# EasyEDA Pro project ESP32_陀螺仪开发板.eprj

# Schematic MainBoard
Create Date: 2023-11-03; Page Name: P1; Project Name: ESP32_陀螺仪开发板; Schematic Name: MainBoard; Update Date: 2023-11-21; Company: 生物科学与医学工程学院; Drawed: 程浩; Page Size: A4; Version: V1.0
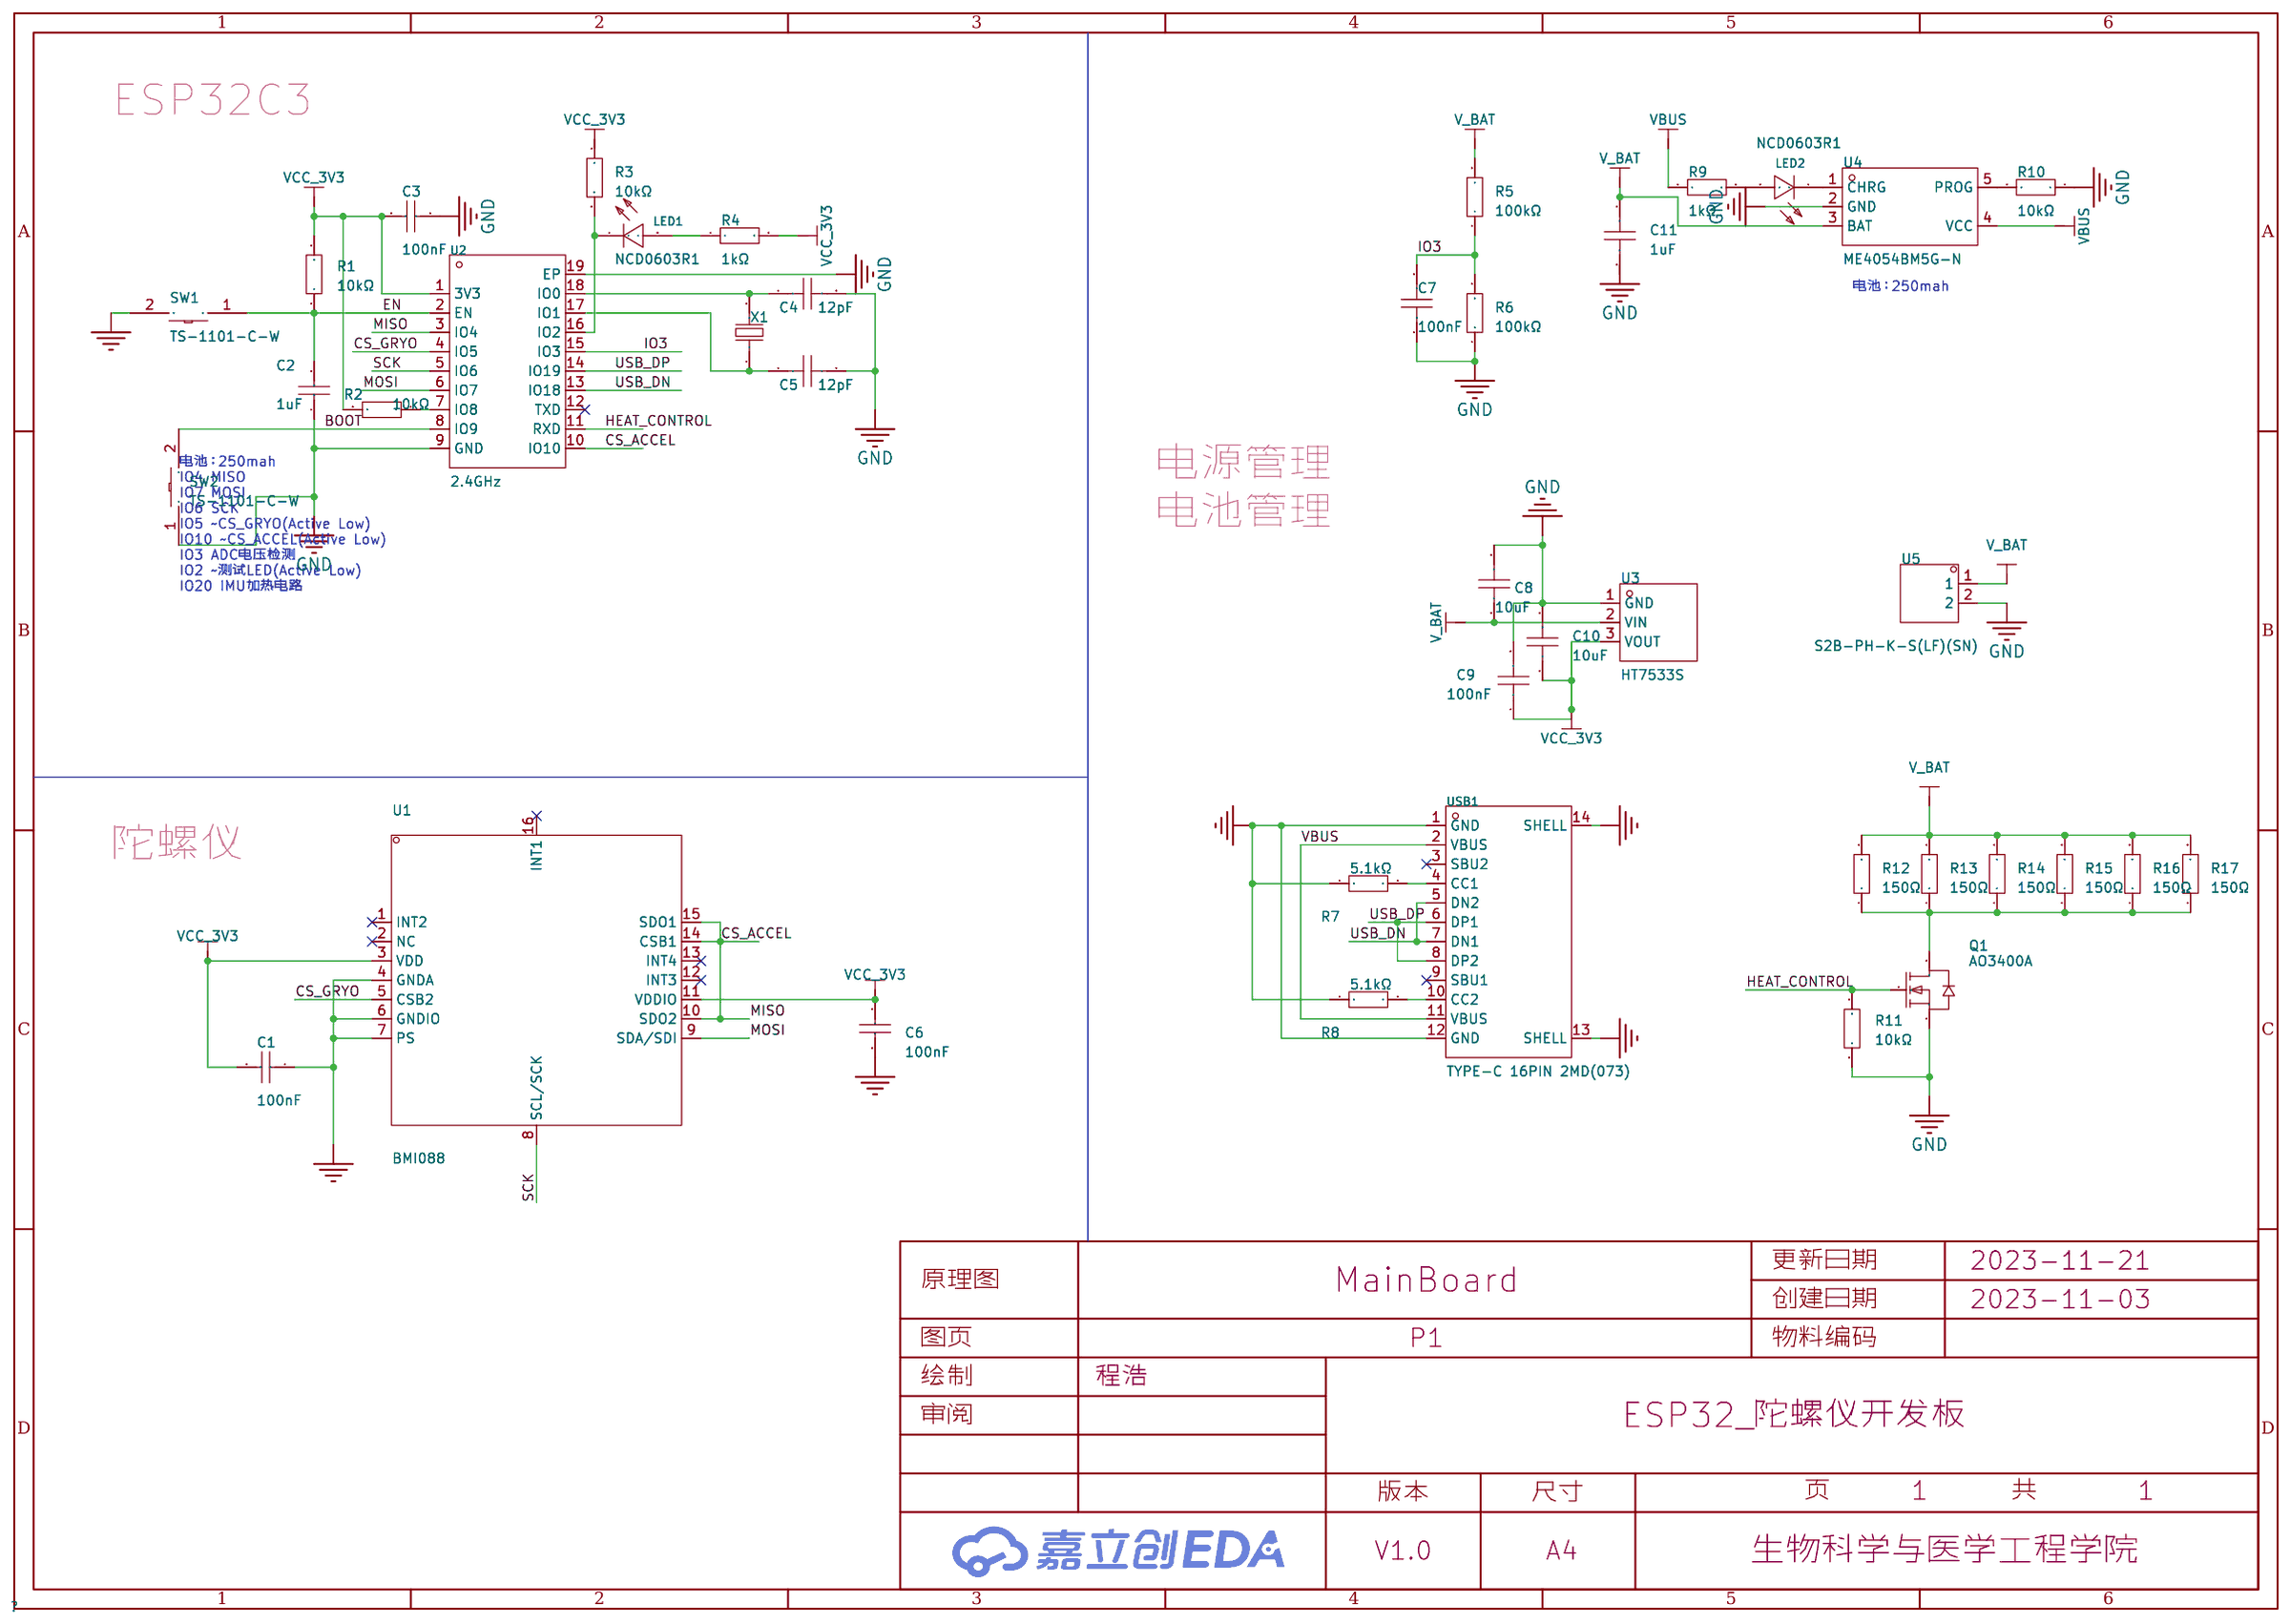
[diagram p0: schematic sheet]

## Parts
C1  100nF  [C0603]
C2  1uF  [C0603]
C3  100nF  [C0603]
C4  12pF  [C0603]
C5  12pF  [C0603]
C6  100nF  [C0603]
C7  100nF  [C0603]
C8  10uF  [C0603]
C9  100nF  [C0603]
C10  10uF  [C0603]
C11  1uF  [C0603]
LED1  NCD0603R1  [LED0603-RD_RED]
LED2  NCD0603R1  [LED0603-RD_RED]
Q1  AO3400A  [SOT-23-3_L2.9-W1.3-P1.90-LS2.4-BR]
R1  10kΩ  [R0603]
R2  10kΩ  [R0603]
R3  10kΩ  [R0603]
R4  1kΩ  [R0603]
R5  100kΩ  [R0603]
R6  100kΩ  [R0603]
R7  5.1kΩ  [R0603]
R8  5.1kΩ  [R0603]
R9  1kΩ  [R0603]
R10  10kΩ  [R0603]
R11  10kΩ  [R0603]
R12  150Ω  [R0603]
R13  150Ω  [R0603]
R14  150Ω  [R0603]
R15  150Ω  [R0603]
R16  150Ω  [R0603]
R17  150Ω  [R0603]
SW1  TS-1101-C-W  [SW-SMD_L6.0-W3.3-LS8.0]
SW2  TS-1101-C-W  [SW-SMD_L6.0-W3.3-LS8.0]
U1  BMI088  [LGA-16_L4.5-W3.0-P0.50-BL]
U2  2.4GHz  [BULETM-SMD_ESPRESSIF_ESP32-C3-WROOM-02-N4-4MB]
U3  HT7533S  [SOT-23-3_L2.9-W1.5-P1.90-LS2.8-BR-CW]
U4  ME4054BM5G-N  [TSOT-23-5_L2.9-W1.6-P0.95-LS2.8-BL]
U5  S2B-PH-K-S(LF)(SN)  [CONN-TH_S2B-PH-K-S-LF-SN]
USB1  TYPE-C 16PIN 2MD(073)  [USB-C-SMD_TYPE-C-6PIN-2MD-073]
X1  32.768kHz  [FC-135R_L3.2-W1.5]

## Library data of the parts
C1 C3 C6 C7 C9 = CC0603KRX7R9BB104: 容值:100nF;精度:±10%;额定电压:50V;材质(温度系数):X7R;; LCSC Part Name: 100nF ±10% 50V; Supplier Part: C14663; Manufacturer: YAGEO(国巨); Supplier Footprint: 0603; JLCPCB Part Class: Basic Part; Datasheet: https://atta.szlcsc.com/upload/public/pdf/source/20180910/C282072_33301C7F631E79921B82A8DAC6BCC5B3.pdf; Supplier: LCSC; Tolerance: ±10%; Voltage Rated: 50V; Temperature Coefficient: X7R
C2 = CL10A105KA8NNNC: 容值:1uF;精度:±10%;额定电压:25V;温度系数:X5R;; LCSC Part Name: 1uF±10%25V; Supplier Part: C5673; Manufacturer: SAMSUNG(三星); Supplier Footprint: 0603; JLCPCB Part Class: ExtendedPart; Datasheet: https://atta.szlcsc.com/upload/public/pdf/source/20160103/1457707739994.pdf; Supplier: LCSC; Tolerance: ±10%; Voltage Rated: 25V; Temperature Coefficient: X5R
C4 C5 = CL10C120JB8NNNC: 容值:12pF;精度:±5%;额定电压:50V;材质(温度系数):C0G;; LCSC Part Name: 12pF ±5% 50V; Supplier Part: C38523; Manufacturer: SAMSUNG(三星); Supplier Footprint: 0603; JLCPCB Part Class: Basic Part; Datasheet: https://atta.szlcsc.com/upload/public/pdf/source/20160218/1457707763339.pdf; Supplier: LCSC; Tolerance: ±5%; Voltage Rated: 50V; Temperature Coefficient: C0G
C8 C10 = CL10A106MA8NRNC: 容值:10uF;精度:±20%;额定电压:25V;材质(温度系数):X5R;; LCSC Part Name: 10uF ±20% 25V; Supplier Part: C96446; Manufacturer: SAMSUNG(三星); Supplier Footprint: 0603; JLCPCB Part Class: Basic Part; Datasheet: https://atta.szlcsc.com/upload/public/pdf/source/20170325/1490427913016.pdf; Supplier: LCSC; Tolerance: ±20%; Voltage Rated: 25V; Temperature Coefficient: X5R
C11 = CL10A105KB8NNNC: 容值:1uF;精度:±10%;额定电压:50V;材质(温度系数):X5R;; LCSC Part Name: 1uF ±10% 50V; Supplier Part: C15849; Manufacturer: SAMSUNG(三星); Supplier Footprint: 0603; JLCPCB Part Class: Basic Part; Datasheet: https://atta.szlcsc.com/upload/public/pdf/source/20160103/1457707679084.pdf; Supplier: LCSC; Tolerance: ±10%; Voltage Rated: 50V; Temperature Coefficient: X5R
LED1 LED2 = NCD0603R1_C84263: 发光颜色:红灯;; LCSC Part Name: 红灯 0603红灯   正贴; Supplier Part: C84263; Manufacturer: 国星光电; Supplier Footprint: 0603; JLCPCB Part Class: 扩展库; Datasheet: https://atta.szlcsc.com/upload/public/pdf/source/20200820/C84263_DABC6A75E58F576973B407FDBA283D60.pdf; Supplier: LCSC; Emitted Color: 红灯
Q1 = AO3400A_C347475: 类型:N沟道;漏源电压(Vdss):30V;连续漏极电流(Id):5.8A;功率(Pd):1.4W;导通电阻(RDS(on)@Vgs,Id):35mΩ@10V,5.8A;; LCSC Part Name: N沟道 30V 5.8A; Supplier Part: C347475; Manufacturer: UMW(广东友台半导体); Supplier Footprint: SOT-23; JLCPCB Part Class: Extended Part; Datasheet: https://atta.szlcsc.com/upload/public/pdf/source/20220429/98B7D6B2B83615ED4523A0C76368EB06.pdf; Supplier: LCSC; Type: N沟道; Drain Source Voltage (Vdss): 30V; Continuous Drain Current (Id): 5.8A; Power Dissipation (Pd): 1.4W; Drain Source On Resistance (RDS(on)@Vgs,Id): 35mΩ@10V,5.8A; Gate Threshold Voltage (Vgs(th)@Id): 1.4V@250uA; Total Gate Charge (Qg@Vgs): 12nC@4.5V; Input Capacitance (Ciss@Vds): 1.05nF@15V; Operating Temperature: -55℃~+150℃@(Tj)
R1-R3 R11 = 0603WAF1002T5E: 电阻类型:厚膜电阻;阻值:10kΩ;精度:±1%;功率:100mW;; LCSC Part Name: 厚膜电阻 10kΩ ±1% 100mW; Supplier Part: C25804; Manufacturer: UNI-ROYAL(厚声); Supplier Footprint: 0603; JLCPCB Part Class: Basic Part; Datasheet: https://atta.szlcsc.com/upload/public/pdf/source/20200306/C422600_1E6D84923E4A46A82E41ADD87F860B5C.pdf; Supplier: LCSC; Type: 厚膜电阻; Tolerance: ±1%; Power(Watts): 100mW; Temperature Coefficient: ±100ppm/℃; Overload Voltage (Max): 75V; Operating Temperature Range: -55℃~+155℃
R4 = 0603WAF1001T5E: 电阻类型:厚膜电阻;阻值:1kΩ;精度:±1%;功率:100mW;温度系数:±100ppm/℃;; LCSC Part Name: 厚膜电阻 1kΩ ±1% 100mW; Supplier Part: C21190; Manufacturer: UNI-ROYAL(厚声); Supplier Footprint: 0603; JLCPCB Part Class: Basic Part; Datasheet: https://atta.szlcsc.com/upload/public/pdf/source/20200306/C422600_1E6D84923E4A46A82E41ADD87F860B5C.pdf; Supplier: LCSC; Type: 厚膜电阻; Tolerance: ±1%; Power(Watts): 100mW; Temperature Coefficient: ±100ppm/℃; Overload Voltage (Max): 75V; Operating Temperature Range: -55℃~+155℃
R5 R6 = 0603WAF1003T5E: 电阻类型:厚膜电阻;阻值:100kΩ;精度:±1%;功率:100mW;; LCSC Part Name: 100kΩ ±1% 100mW; Supplier Part: C25803; Manufacturer: UNI-ROYAL(厚声); Supplier Footprint: 0603; JLCPCB Part Class: Basic Part; Datasheet: https://atta.szlcsc.com/upload/public/pdf/source/20200306/C422600_1E6D84923E4A46A82E41ADD87F860B5C.pdf; Supplier: LCSC; Type: 厚膜电阻; Tolerance: ±1%; Power(Watts): 100mW; Temperature Coefficient: ±100ppm/℃; Overload Voltage (Max): 75V; Operating Temperature Range: -55℃~+155℃
R7 R8 = 0603WAF5101T5E: 电阻类型:厚膜电阻;阻值:5.1kΩ;精度:±1%;功率:100mW;; LCSC Part Name: 5.1kΩ ±1% 100mW; Supplier Part: C23186; Manufacturer: UNI-ROYAL(厚声); Supplier Footprint: 0603; JLCPCB Part Class: Basic Part; Datasheet: https://atta.szlcsc.com/upload/public/pdf/source/20200306/C422600_1E6D84923E4A46A82E41ADD87F860B5C.pdf; Supplier: LCSC; Type: 厚膜电阻; Tolerance: ±1%; Power(Watts): 100mW; Temperature Coefficient: ±100ppm/℃; Overload Voltage (Max): 75V; Operating Temperature Range: -55℃~+155℃
R9 = 0603WAF1001T5E: 电阻类型:厚膜电阻;阻值:1kΩ;精度:±1%;功率:100mW;; LCSC Part Name: 1kΩ ±1% 100mW; Supplier Part: C21190; Manufacturer: UNI-ROYAL(厚声); Supplier Footprint: 0603; JLCPCB Part Class: Basic Part; Datasheet: https://atta.szlcsc.com/upload/public/pdf/source/20200306/C422600_1E6D84923E4A46A82E41ADD87F860B5C.pdf; Supplier: LCSC; Type: 厚膜电阻; Tolerance: ±1%; Power(Watts): 100mW; Temperature Coefficient: ±100ppm/℃; Overload Voltage (Max): 75V; Operating Temperature Range: -55℃~+155℃
R10 = 0603WAF2001T5E: 电阻类型:厚膜电阻;阻值:2kΩ;精度:±1%;功率:100mW;; LCSC Part Name: 2kΩ ±1% 100mW; Supplier Part: C22975; Manufacturer: UNI-ROYAL(厚声); Supplier Footprint: 0603; JLCPCB Part Class: Basic Part; Datasheet: https://atta.szlcsc.com/upload/public/pdf/source/20200306/C422600_1E6D84923E4A46A82E41ADD87F860B5C.pdf; Supplier: LCSC; Type: 厚膜电阻; Tolerance: ±1%; Power(Watts): 100mW; Temperature Coefficient: ±100ppm/℃; Overload Voltage (Max): 75V; Operating Temperature Range: -55℃~+155℃
R12-R17 = 0603WAF1500T5E: 电阻类型:厚膜电阻;阻值:150Ω;精度:±1%;功率:100mW;温度系数:±100ppm/℃;; LCSC Part Name: 厚膜电阻 150Ω ±1% 100mW; Supplier Part: C22808; Manufacturer: UNI-ROYAL(厚声); Supplier Footprint: 0603; JLCPCB Part Class: 基础库; Datasheet: https://atta.szlcsc.com/upload/public/pdf/source/20200306/C422600_1E6D84923E4A46A82E41ADD87F860B5C.pdf; Supplier: LCSC; Type: 厚膜电阻; Tolerance: ±1%; Power(Watts): 100mW; Temperature Coefficient: ±100ppm/℃; Overload Voltage (Max): 75V; Operating Temperature Range: -55℃~+155℃
SW1 SW2 = TS-1101-C-W: 触点电流:50mA;额定电压(AC):-;额定电压(DC):12V;额定功率:-;绝缘电阻:-;电路结构:单刀单掷;安装方式:立贴;带灯:无;作用力:260gf;机械寿命:5万次;带支架:否;; LCSC Part Name: 立贴 6*3.6*2.5mm 轻触开关 一型3*6*2.5有白ZD b拉伸白色带淡绿按键 卷装; Supplier Part: C318938; Manufacturer: XKB Connectivity(中国星坤); Supplier Footprint: SMD; JLCPCB Part Class: Extended Part; Datasheet: https://atta.szlcsc.com/upload/public/pdf/source/20200227/C318938_C2E53B1EEDE37D980A33616AC086DE53.pdf; Supplier: LCSC; Contact Current: 50mA; Voltage Rating (DC): 12V; Circuit: 单刀单掷; Mounting Style: 立贴; Actuator Style: 矩形按钮; Actuator/Cap Color: 白色带淡绿; With Lamp: 无; Operating Force: 260gf; Mechanical Life: 5万次; Operating Temperature: -30℃~+85℃; Switch Length: 6mm; Switch Width: 3.6mm; Switch Height: 2.5mm; Strike Gundam: 否
U1 = BMI088: Supplier Part: C194919; Manufacturer: Bosch(博世); Supplier Footprint: LGA-16; JLCPCB Part Class: 扩展库; Datasheet: https://atta.szlcsc.com/upload/public/pdf/source/20180628/C194919_66CCF125FF968C218A4D358C68AC68D6.pdf; Supplier: LCSC
U2 = ESP32-C3-WROOM-02-N4: 频率:2.4GHz;发射功率:20.5dBm;核心处理器:ESP32-C3;; Supplier Part: C2934560; Manufacturer: ESPRESSIF(乐鑫); Supplier Footprint: VFQFN-32-EP; JLCPCB Part Class: Extended Part; Datasheet: https://atta.szlcsc.com/upload/public/pdf/source/20220106/F07459EFFE1D7CBA94B4FB8A075146A6.pdf; Supplier: LCSC; Output Power: 20.5dBm; Core Processor: ESP32-C3; Support Interface: I2C；GPIO；SPI；JTAG；UART；USB；I2S
U3 = HT7533S: 输出类型:固定;输出极性:正;最大输入电压:30V;输出电压:3.3V;输出电流:100mA;电源纹波抑制比(PSRR):-;; LCSC Part Name: 输入30V 输出3.3V 100mA; Supplier Part: C347215; Manufacturer: UMW(友台半导体); Supplier Footprint: SOT-23(TO-236); JLCPCB Part Class: 扩展库; Datasheet: https://atta.szlcsc.com/upload/public/pdf/source/20220507/34620B1C4E900F09B55437D1160C5F5F.pdf; Supplier: LCSC; Output Type: 固定; Output Polarity: 正; Number of Outputs: 1; Maximum Input Voltage: 30V; Output Voltage: 3.3V; Dropout Voltage: 100mV@(1mA); Output Current: 100mA
U4 = ME4054BM5G-N: Supplier Part: C478383; Manufacturer: MICRONE(南京微盟); Supplier Footprint: SOT-23-5; JLCPCB Part Class: Extended Part; Datasheet: https://atta.szlcsc.com/upload/public/pdf/source/20191226/C478383_334A5ED125CA9F8F85F7DE0AC0ECFE6D.pdf; Supplier: LCSC
U5 = S2B-PH-K-S(LF)(SN): 参考系列:PH;间距:2mm;插针结构:1x2P;排数:1;每排PIN数:2;行距:-;安装方式:-;触头材质:黄铜;; LCSC Part Name: PH 2mm 1x2P 打K; Supplier Part: C173752; Manufacturer: JST; Supplier Footprint: 弯插,P=2mm; JLCPCB Part Class: Extended Part; Datasheet: https://atta.szlcsc.com/upload/public/pdf/source/20180327/C173752_5C91EDA4B54CB1D33BA17C4D2B983D44.pdf; Supplier: LCSC; Reference Series: PH; Pitch: 2mm; Pins Structure: 1x2P; Number of Rows: 1; Number of PINs Per Row: 2; Contact Material: 黄铜
USB1 = TYPE-C 16PIN 2MD(073): 连接器类型:Type-C;标准:-;公母:母座;触点数量:16;端口数量:1;安装方式:卧贴;额定电流 - 电源:5A;工作温度范围:-25℃~+85℃;; LCSC Part Name: TYPE-C母座 16P 4脚插件带定位柱 不锈钢外壳 2次模顶; Supplier Part: C2765186; Manufacturer: SHOU HAN(首韩); Supplier Footprint: SMD; JLCPCB Part Class: 扩展库; Supplier: LCSC; Connector Type: Type-C; Gender: 母座; Number of Contacts: 16; Number of Ports: 1; Mounting Style: 卧贴; Current Rating - Power (Max): 5A; Operating Temperature Range: -25℃~+85℃
X1 = Q13FC1350000400: 频率:32.768kHz;频率公差:±20ppm;负载电容:12.5pF;; LCSC Part Name: 32.768kHz ±20ppm 12.5pF; Supplier Part: C32346; Manufacturer: EPSON(爱普生); Supplier Footprint: SMD3215-2P; JLCPCB Part Class: Basic Part; Datasheet: https://atta.szlcsc.com/upload/public/pdf/source/20190108/C32346_746D6B07EAF90824457A96480007685F.pdf; Supplier: LCSC; Crystal Type: 贴片无源晶振; Frequency Tolerance: ±20ppm; Load Capacitance: 12.5pF; Equivalent Series Resistance (ESR): 70kΩ; Operating Temperature: -40℃~+85℃

## Nets
GND: C1.1 C2.1 C3.1 C4.2 C5.2 C6.2 C7.1 C8.2 C9.2 C10.2 C11.2 Q1.2(S) R6.1 R7.1 R8.1 R10.1 R11.1 SW1.2 SW2.1 U1.4(GNDA) U1.6(GNDIO) U1.7(PS) U2.9(GND) U2.19(EP) U3.1(GND) U4.2(GND) U5.2 USB1.1(GND) USB1.12(GND) USB1.13(SHELL) USB1.14(SHELL)
VBUS: R9.1 U4.4(VCC) USB1.2(VBUS) USB1.11(VBUS)
VCC_3V3: C1.2 C3.2 C6.1 C9.1 C10.1 R1.2 R2.2 R3.1 R4.2 U1.3(VDD) U1.11(VDDIO) U2.1(3V3) U3.3(VOUT)
BOOT: SW2.2 U2.8(IO9)
CS_ACCEL: U1.14(CSB1) U2.10(IO10)
CS_GRYO: U1.5(CSB2) U2.4(IO5)
EN: C2.2 R1.1 SW1.1 U2.2(EN)
HEAT_CONTROL: Q1.1(G) R11.2 U2.11(RXD)
IO3: C7.2 R5.1 R6.2 U2.15(IO3)
MISO: U1.10(SDO2) U1.15(SDO1) U2.3(IO4)
MOSI: U1.9(SDA/SDI) U2.6(IO7)
SCK: U1.8(SCL/SCK) U2.5(IO6)
USB_DN: U2.13(IO18) USB1.5(DN2) USB1.7(DN1)
USB_DP: U2.14(IO19) USB1.6(DP1) USB1.8(DP2)
V_BAT: C8.1 C11.1 R5.2 R12.2 R13.2 R14.2 R15.2 R16.2 R17.2 U3.2(VIN) U4.3(BAT) U5.1
$1N942: C4.1 U2.18(IO0) X1.2
$1N943: C5.1 U2.17(IO1) X1.1
$1N945: R2.1 U2.7(IO8)
$1N2191: R7.2 USB1.4(CC1)
$1N2192: R8.2 USB1.10(CC2)
$1N5073: R10.2 U4.5(PROG)
$1N10331: Q1.3(D) R12.1 R13.1 R14.1 R15.1 R16.1 R17.1
Net-(LED1-1): LED1.1(K) R3.2 U2.16(IO2)
Net-(LED1-2): LED1.2(A) R4.1
Net-(LED2-1): LED2.1(K) U4.1(CHRG)
Net-(LED2-2): LED2.2(A) R9.2

Not connected (* = marked no-connect by the designer): U1 1(INT2)* 2(NC)* 12(INT3)* 13(INT4)* 16(INT1)*; U2 12(TXD)*; USB1 3(SBU2)* 9(SBU1)*

## Notes on the sheet
- ESP32C3
- 电池：250mah
- 电源管理
  电池管理
- 电池：250mah
  IO4 MISO
  IO7 MOSI
  IO6 SCK
  IO5 ~CS_GRYO(Active Low)
  IO10 ~CS_ACCEL(Active Low)
  IO3 ADC电压检测
  IO2 ~测试LED(Active Low)
  IO20 IMU加热电路
- 陀螺仪

# Board PCB1
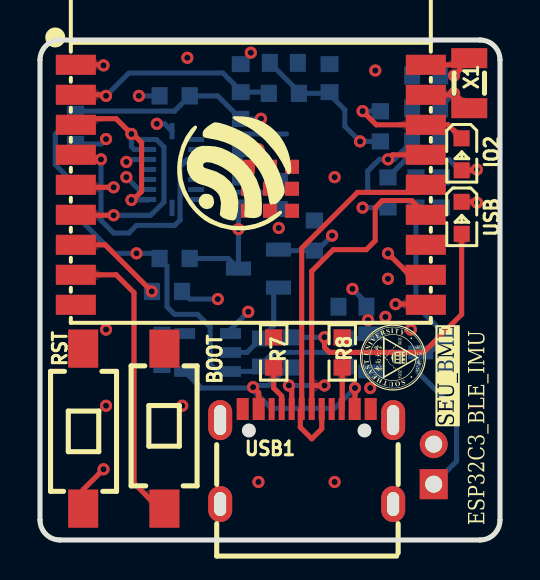
[diagram p1: board, top side]
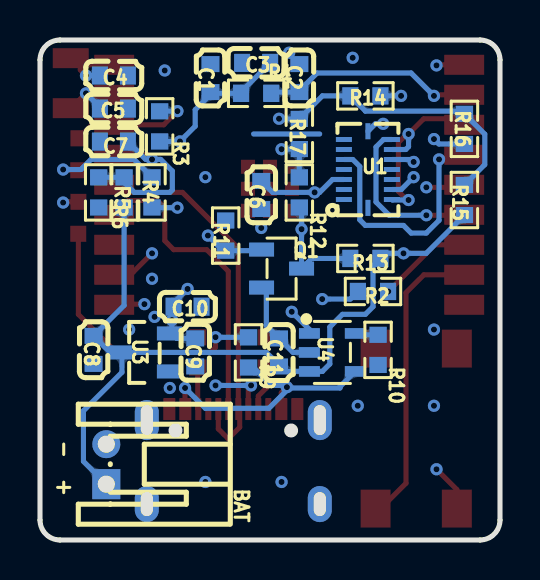
[diagram p2: board, bottom side, seen from below]

Outline 23 x 25 mm; copper layers: Top Layer, Inner1, Inner2, Bottom Layer. Coordinates in mm from the lower left corner of the outline.
Outline path: 0,24 0,1 arc(0.29,0.29) 1,0 22,0 arc(22.71,0.29) 23,1 23,24 arc(22.71,24.71) 22,25 1,25 arc(0.29,24.71) 0,24
Stack: Top Layer 0.035mm 外层铜厚1oz / Dielectric1 0.2104mm 7628 RC49% 8.6mil / Inner1 0.0152mm 内层铜厚 / Dielectric2 1.065mm 1.1mm H/HOZ 含铜 / Inner2 0.0152mm 内层铜厚 / Dielectric3 0.2104mm 7628 RC49% 8.6mil / Bottom Layer 0.035mm 外层铜厚1oz

## Design rules (mm)
net USB_DN: DP1
net USB_DP: DP1
template: 自定义配置
spacing copperThickness1oz (default): track to track 0.102, other pairs 0.152 to 0.3
spacing copperThickness2oz: track to track 0.203, other pairs 0.152 to 0.3
track width copperThickness1oz (default): min 0.127, default 0.254, max 2.54
track width copperThickness2oz: min 0.203, default 0.254, max 2.54
differential pair differentialPair (default): width min 0.127, default 0.254, max 2.54; gap min 0.152, default 0.152
via viaSize (default): diameter min 0.5, default 0.61, max 10; hole min 0.3, default 0.305, max 6.3
net GND uses POWER

## Placement (name value [footprint] x y rotation side)
BAT  S2B-PH-K-S(LF)(SN)  [CONN-TH_S2B-PH-K-S-LF-SN]  19.69 3.79 270 bottom
BOOT  TS-1101-C-W  [SW-SMD_L6.0-W3.3-LS8.0]  6.22 5.57 270 top
C1  100nF  [C0603]  14.48 23.09 270 bottom
C2  1uF  [C0603]  10.03 23.09 270 bottom
C3  100nF  [C0603]  12.19 23.86 180 bottom
C4  12pF  [C0603]  19.3 23.22 180 bottom
C5  12pF  [C0603]  19.3 21.57 180 bottom
C6  100nF  [C0603]  11.94 17.25 270 bottom
C7  100nF  [C0603]  19.3 19.92 180 bottom
C8  10uF  [C0603]  20.32 9.51 270 bottom
C9  100nF  [C0603]  15.24 9.38 270 bottom
C10  10uF  [C0603]  15.62 11.67 180 bottom
C11  1uF  [C0603]  11.05 9.38 90 bottom
IO2  NCD0603R1  [LED0603-RD_RED]  21.08 19.28 270 top
Q1  AO3400A  [SOT-23-3_L2.9-W1.3-P1.90-LS2.4-BR]  10.92 13.57 0 bottom
R1  10kΩ  [R0603]  12.19 22.33 0 bottom
R2  10kΩ  [R0603]  6.35 12.43 0 bottom
R3  10kΩ  [R0603]  17.02 20.68 90 bottom
R4  1kΩ  [R0603]  17.4 17.38 270 bottom
R5  100kΩ  [R0603]  18.8 17.38 270 bottom
R6  100kΩ  [R0603]  20.07 17.38 90 bottom
R7  5.1kΩ  [R0603]  11.68 9.38 270 top
R8  5.1kΩ  [R0603]  15.11 9.38 270 top
R9  1kΩ  [R0603]  12.57 9.38 90 bottom
R10  10kΩ  [R0603]  6.1 9.51 90 bottom
R11  10kΩ  [R0603]  13.72 15.22 270 bottom
R12  150Ω  [R0603]  10.03 17.38 90 bottom
R13  150Ω  [R0603]  6.73 14.08 180 bottom
R14  150Ω  [R0603]  6.73 22.21 180 bottom
R15  150Ω  [R0603]  1.78 17 270 bottom
R16  150Ω  [R0603]  1.78 20.56 270 bottom
R17  150Ω  [R0603]  10.03 20.3 270 bottom
RST  TS-1101-C-W  [SW-SMD_L6.0-W3.3-LS8.0]  2.16 5.57 90 top
U1  BMI088  [LGA-16_L4.5-W3.0-P0.50-BL]  6.6 18.52 180 bottom
U2  2.4GHz  [BULETM-SMD_ESPRESSIF_ESP32-C3-WROOM-02-N4-4MB]  10.54 17.76 0 top
U3  HT7533S  [SOT-23-3_L2.9-W1.5-P1.90-LS2.8-BR-CW]  17.78 9.38 180 bottom
U4  ME4054BM5G-N  [TSOT-23-5_L2.9-W1.6-P0.95-LS2.8-BL]  8.38 9.38 270 bottom
USB  NCD0603R1  [LED0603-RD_RED]  21.08 16.11 270 top
USB1  TYPE-C 16PIN 2MD(073)  [USB-C-SMD_TYPE-C-6PIN-2MD-073]  13.34 4.17 0 top
X1  32.768kHz  [FC-135R_L3.2-W1.5]  21.46 22.84 90 top

## Footprints (pads in the part's own frame, mm; a bottom-side part is the same pattern mirrored in y, then rotated)
BULETM-SMD_ESPRESSIF_ESP32-C3-WROOM-02-N4-4MB
  rect 2x1 smd: 1(-8.75,6) 2(-8.75,4.5) 3(-8.75,3) 4(-8.75,1.5) 5(-8.75,0) 6(-8.75,-1.5) 7(-8.75,-3) 8(-8.75,-4.5) 9(-8.75,-6) 10(8.75,-6) 11(8.75,-4.5) 12(8.75,-3) 13(8.75,-1.5) 14(8.75,0) 15(8.75,1.5) 16(8.75,3) 17(8.75,4.5) 18(8.75,6)
  rect 0.7x0.7 smd: 19(-0.14,0.9) 19(-0.14,-0.2) 19(-0.14,-1.3) 19(0.96,0.9) 19(0.96,-0.2) 19(0.96,-1.3) 19(2.06,0.9) 19(2.06,-0.2) 19(2.06,-1.3)
C0603
  rect 0.8x0.9 smd: 1(-0.7,0) 2(0.7,0)
CONN-TH_S2B-PH-K-S-LF-SN
  rect 1.5x1.4 hole 0.85: 1(1,0)
  round 1.4 hole 0.85: 2(-1,0)
FC-135R_L3.2-W1.5
  rect 1x1.8 smd: 1(-1.25,0) 2(1.25,0)
LED0603-RD_RED
  rect 0.8x0.8 smd: 1(-0.799,-0.004) 2(0.799,0.004)
LGA-16_L4.5-W3.0-P0.50-BL
  rect 0.8x0.25 smd: 1(-1.2,-1.498) 2(-1.2,-0.998) 3(-1.2,-0.498) 4(-1.2,0.002) 5(-1.2,0.502) 6(-1.2,1.002) 7(-1.2,1.502) 9(1.2,1.502) 10(1.2,1.002) 11(1.2,0.502) 12(1.2,0.002) 13(1.2,-0.498) 14(1.2,-0.998) 15(1.2,-1.498)
  rect 0.25x0.8 smd: 8(0,1.915) 16(0,-1.915)
R0603
  rect 0.806x0.864 smd: 1(-0.753,0) 2(0.753,0)
SOT-23-3_L2.9-W1.3-P1.90-LS2.4-BR
  rect 1.25x0.7 smd: 1(1,-0.95) 2(1,0.95) 3(-1,0)
SOT-23-3_L2.9-W1.5-P1.90-LS2.8-BR-CW
  rect 1.25x0.7 smd: 1(1.25,-0.95) 2(-1.25,0) 3(1.25,0.95)
SW-SMD_L6.0-W3.3-LS8.0
  rect 1.9x1.5 smd: 1(-4,0) 2(4,0)
TSOT-23-5_L2.9-W1.6-P0.95-LS2.8-BL
  rect 0.532x1.045 smd: 1(-0.95,-1.147) 2(0,-1.147) 3(0.95,-1.147) 4(0.95,1.147) 5(-0.95,1.147)
USB-C-SMD_TYPE-C-6PIN-2MD-073
  rect 0.6x1.1 smd: 1(-3.2,2.375) 2(-2.4,2.375) 11(2.4,2.375) 12(3.2,2.375)
  rect 0.3x1.1 smd: 3(-1.75,2.375) 4(-1.25,2.375) 5(-0.75,2.375) 6(-0.25,2.375) 7(0.25,2.375) 8(0.75,2.375) 9(1.25,2.375) 10(1.75,2.375)
  oval 1.2x2 hole 0.6x1.5: 13(-4.325,1.825) 14(4.325,1.825)
  oval 1.2x1.8 hole 0.6x1.2: 13(-4.325,-2.375) 14(4.325,-2.375)

## Nets
GND: BAT.2 BOOT.1 C1.1 C2.1 C3.1 C4.2 C5.2 C6.2 C7.1 C8.2 C9.2 C10.2 C11.2 Q1.2 R6.1 R7.1 R8.1 R10.1 R11.1 RST.2 U1.4 U1.6 U1.7 U2.9 U2.19 U3.1 U4.2 USB1.1 USB1.12 USB1.13 USB1.14
VBUS: R9.1 U4.4 USB1.2 USB1.11
VCC_3V3: C1.2 C3.2 C6.1 C9.1 C10.1 R1.2 R2.2 R3.1 R4.2 U1.3 U1.11 U2.1 U3.3
BOOT: BOOT.2 U2.8
CS_ACCEL: U1.14 U2.10
CS_GRYO: U1.5 U2.4
EN: C2.2 R1.1 RST.1 U2.2
HEAT_CONTROL: Q1.1 R11.2 U2.11
IO3: C7.2 R5.1 R6.2 U2.15
MISO: U1.10 U1.15 U2.3
MOSI: U1.9 U2.6
SCK: U1.8 U2.5
USB_DN: U2.13 USB1.5 USB1.7
USB_DP: U2.14 USB1.6 USB1.8
V_BAT: BAT.1 C8.1 C11.1 R5.2 R12.2 R13.2 R14.2 R15.2 R16.2 R17.2 U3.2 U4.3
$1N942: C4.1 U2.18 X1.2
$1N943: C5.1 U2.17 X1.1
$1N945: R2.1 U2.7
$1N2191: R7.2 USB1.4
$1N2192: R8.2 USB1.10
$1N2715: IO2.1 R3.2 U2.16
$1N5073: R10.2 U4.5
$1N6633: U4.1 USB.1
$1N6635: R9.2 USB.2
$1N6712: IO2.2 R4.1
$1N10331: Q1.3 R12.1 R13.1 R14.1 R15.1 R16.1 R17.1

Pads without a net: U1 1 2 12 13 16; U2 12; USB1 3 9

## Via types
v1: diameter 0.61, hole 0.305, Top Layer to Bottom Layer, 53 vias

## Routing (per net, layer and track width the routed paths; a pad name or vN(x,y) marks a point on that pad's centre or on a via; arc(x,y) is an arc through that point)
GND: length 8
  Bottom Layer w0.254: U4.2 10.35,9.38 C11.2 11.68,10.71 11.68,12.38 Q1.2 ; 9.02,20.3 12.32,20.3
  vias: v1(3.3,10.52) v1(3.3,6.71) v1(7.11,6.71) v1(10.54,24.36) v1(10.92,2.9) v1(11.94,15.6) v1(14.73,18.14) v1(14.73,2.9) v1(16.51,7.6) v1(16.76,23.48) v1(17.27,11.16) v1(17.4,13.06) v1(18.54,10.52)
VBUS: length 14.1
  Top Layer w0.254: v1(10.65,7.64) 10.94,7.36 USB1.2 ; USB1.11 15.75,6.56 15.75,7.35
  Bottom Layer w0.254: 10.54,7.6 8,7.6 8,7.66 U4.4 ; v1(15.75,7.6) 14.73,6.58 11.56,6.58 10.65,7.49 v1(10.65,7.64) 10.74,7.73 11.43,7.73 12.33,8.63 R9.1
VCC_3V3: length 35.4
  Top Layer w0.254: v1(3.18,23.73) 3.14,23.76 U2.1
  Inner1 w0.254: v1(9.27,17.38) 9.65,17.76 9.65,19.28 7.37,21.57 v1(7.37,24.11)
  Inner1 w0.381: v1(9.27,17.38) 8.25,17.38 6.73,18.9 v1(4.32,18.9)
  Bottom Layer w0.254: R4.2 17.39,16.62 v1(16.13,16.62) ; v1(15.62,12.55) 16.32,11.85 C10.1 16.4,11.58 v1(16.4,11) 16.4,10.33 16.15,10.08 C9.1 ; R3.1 v1(16,19.93) 15.24,20.69 15.24,21.51 14.42,22.33 ; C3.2 12.95,22.4 R1.2 14.42,22.33 ; v1(8.89,12.05) 7.48,12.05 R2.2 ; 14.42,22.33 C1.2 ; U1.11 4.44,19.03 v1(4.32,18.9) ; C6.1 11.37,17.38 v1(9.27,17.38) 9.02,17.38 8.37,18.03 U1.3
BOOT: length 14.1
  Top Layer w0.254: 6.22,1.31 4.7,2.84 4.7,12.37 3.81,13.26 2.68,13.26
CS_ACCEL: length 22.8
  Top Layer w0.254: v1(17.78,11.79) 19.26,11.79 U2.10
  Inner1 w0.254: v1(4.32,18.14) 4.88,18.14 7.11,15.91 7.11,11.16 7.75,10.52 12.45,10.52 13.72,11.79 v1(17.78,11.79)
  Bottom Layer w0.254: v1(4.32,18.14) 4.94,17.53 U1.14
CS_GRYO: length 12.5
  Top Layer w0.254: v1(3.05,19.03) 2.02,19.03 U2.4
  Bottom Layer w0.254: U1.5 7.36,19.03 7.01,18.67 7.01,16.01 6.73,15.73 4.83,15.73 4.44,15.35 3.68,15.35 3.05,15.98 v1(3.05,19.03)
EN: length 32.6
  Top Layer w0.254: v1(3.3,22.21) 3.25,22.26 U2.2 ; RST.1 2.16,2.52 v1(3.18,3.54)
  Inner1 w0.254: v1(3.3,22.21) 3.3,21.32 2.16,20.17 2.16,4.55 v1(3.18,3.54)
  Bottom Layer w0.254: v1(3.3,22.21) 4.44,23.35 9.14,23.35 10.03,22.46 C2.2 11.38,22.39 R1.1
HEAT_CONTROL: length 8.5
  Top Layer w0.254: U2.11 18.47,13.26 v1(17.4,14.33)
  Inner1 w0.254: v1(17.4,14.33) 16.51,15.22 v1(14.6,15.22)
  Bottom Layer w0.254: Q1.1 11.97,14.47 R11.2 13.85,14.47 v1(14.6,15.22)
IO3: length 9.9
  Top Layer w0.254: U2.15 17.63,19.26 v1(17.4,19.03)
  Bottom Layer w0.254: C7.2 17.72,19.03 v1(17.4,19.03) 16.97,19.03 16.38,18.45 16.38,17.51 16.51,17.38 18.29,17.38 18.8,17.89 R5.1 R6.2
MISO: length 9.4
  Top Layer w0.254: v1(4.57,17) 4.65,17 5.08,17.43 5.08,19.87 4.65,20.3 v1(4.57,20.3) 3.81,21.06 2.09,21.06 U2.3
  Bottom Layer w0.254: v1(4.57,17) 5.38,17 U1.15 ; U1.10 4.71,19.53 4.57,19.67 v1(4.57,20.3)
MOSI: length 8.1
  Top Layer w0.254: v1(3.68,16.24) 1.81,16.24 U2.6
  Bottom Layer w0.254: 3.94,16.24 5.54,16.24 6.2,16.9 6.2,19.65 5.82,20.03 U1.9
SCK: length 7.4
  Top Layer w0.254: U2.5 1.92,17.63 v1(3.68,17.63)
  Inner1 w0.254: v1(3.68,17.63) 3.68,19.16 4.06,19.54 4.83,19.54 5.84,20.56 v1(5.84,20.81)
  Bottom Layer w0.254: U1.8 6.23,20.81 v1(5.84,20.81)
USB_DN: length 18.9
  Top Layer w0.254: v1(12.45,7.73) 12.59,7.59 USB1.5 ; U2.13 18.58,16.97 17.12,16.97 16.76,16.61 16.76,14.96 16.31,14.52 14.66,14.52 13.59,13.44 USB1.7 ; 13.66,7.73 v1(14.22,7.73)
  Bottom Layer w0.254: v1(12.45,7.73) v1(14.22,7.73)
USB_DP: length 19
  Top Layer w0.254: U2.14 18.91,17.38 15.88,17.38 13.09,14.59 USB1.6 13.01,6.48 13.01,5.64 13.59,5.06 14.09,5.56 USB1.8
V_BAT: length 44.7
  Bottom Layer w0.254: 18.9,9.38 19.49,9.38 C8.1 18.8,11.73 R5.2 ; 18.9,9.38 18.9,8.38 20.83,6.46 20.83,3.93 BAT.1 ; 18.9,9.38 11.68,9.38 10.73,8.43 U4.3 8.88,8.43 8.51,8.8 8.51,10.65 7.87,11.28 6.73,11.28 6.35,11.67 6.35,13.71 R13.2 5.72,14.33 v1(4.82,14.33) 3.69,14.33 R15.2 ; R12.2 R17.2 10.04,19.54 v1(10.92,19.54) ; v1(4.95,22.21) R14.2 ; R16.2 3.06,19.8 v1(3.3,20.05)
$1N942: length 1.8
  Top Layer w0.254: v1(20.7,23.22) 20.99,23.51 20.99,23.76 20.31,23.76
  Bottom Layer w0.254: v1(20.7,23.22) 20.26,23.22
$1N943: length 3.2
  Top Layer w0.254: X1.1 21.44,21.59 v1(20.7,22.33) 20.63,22.26 19.67,22.26
  Bottom Layer w0.254: v1(20.7,22.33) 20,21.64 C5.1
$1N945: length 4.8
  Top Layer w0.254: v1(5.59,12.43) 3.25,14.76 U2.7
  Bottom Layer w0.254: v1(5.59,12.43) R2.1
$1N2191: length 2.2
  Top Layer w0.254: USB1.4 12.09,7.2 11.68,7.6 R7.2
$1N2192: length 2.1
  Top Layer w0.254: USB1.10 15.11,6.58 R8.2
$1N2715: length 6.4
  Top Layer w0.254: v1(16.13,21.44) 16.81,20.76 U2.16 20.4,20.76 IO2.1
  Bottom Layer w0.254: v1(16.13,21.44) 17.01,21.44 R3.2
$1N5073: length 1.2
  Bottom Layer w0.254: 7.23,10.33 7.16,10.26 R10.2
$1N6633: length 15.9
  Top Layer w0.254: v1(21.84,16.87) 21.81,16.91 USB.1
  Inner1 w0.254: v1(21.84,16.87) 18.67,13.7 12.7,13.7 v1(10.41,11.41)
  Bottom Layer w0.254: v1(10.41,11.41) 9.53,10.53 9.53,10.33
$1N6635: length 13.8
  Top Layer w0.254: USB.2 21.08,15.31 21.08,11.28 19.18,9.38 14.48,9.38 14.22,9.63 v1(14.22,10.14)
  Bottom Layer w0.254: 12.7,10.13 14.22,10.13 v1(14.22,10.14)
$1N6712: length 5.8
  Top Layer w0.254: IO2.2 21.81,18.49 v1(21.84,18.52)
  Bottom Layer w0.254: v1(21.84,18.52) 20.96,18.52 20.45,19.03 18.3,19.03 R4.1
$1N10331: length 27.7
  Inner1 w0.508: v1(11.05,21.06) 12.19,19.92 12.19,17 10.73,15.54 v1(9.92,15.54)
  Bottom Layer w0.254: v1(11.05,21.06) 11.04,21.05 R17.1 8.88,22.21 R14.1 6.73,21.45 6.73,21.44 1.91,21.44 R16.1 0.76,20.29 0.76,18.77 R15.1 ; R13.1 9.41,14.08 Q1.3 v1(9.92,15.54) 9.92,16.52 R12.1

## Copper pours and planes (outline as drawn; the poured copper is in the pictures)
GND on Top Layer: -3.18,26.27 26.29,26.27 26.29,-2.69 -3.18,-2.69
GND on Bottom Layer: 24.44,-0.91 24.44,25.64 8.51,25.64 8.51,23.01 11.24,22.99 11.24,12.68 -0.51,12.68 -0.51,-0.91
GND on Bottom Layer: 1.14,23.02 10.88,23.02 10.88,13.32 1.14,13.32
GND on Inner1: -2.41,26.65 26.67,26.65 26.67,-0.76 -2.41,-0.76
VCC_3V3 on Inner2: 19.61,9.77 19.61,24.54 1.58,24.54 1.54,24.5 1.54,22.92 12.19,22.92 12.19,12.41 7.71,12.43 7.7,9.51 19.38,9.55
V_BAT on Inner2: 1.4,22.59 11.43,22.59 11.43,12.94 1.4,12.94

Small or netless copper shapes (teardrops, artwork), in the pictures only: 55 on Top Layer, 103 on Bottom Layer, 15 on Inner1

## Text on the board
Bottom Silkscreen Layer: - | +
Top Silkscreen Layer: SEU_BME | ESP32C3_BLE_IMU
